# Altium project Large 2 Sided.PrjPcb
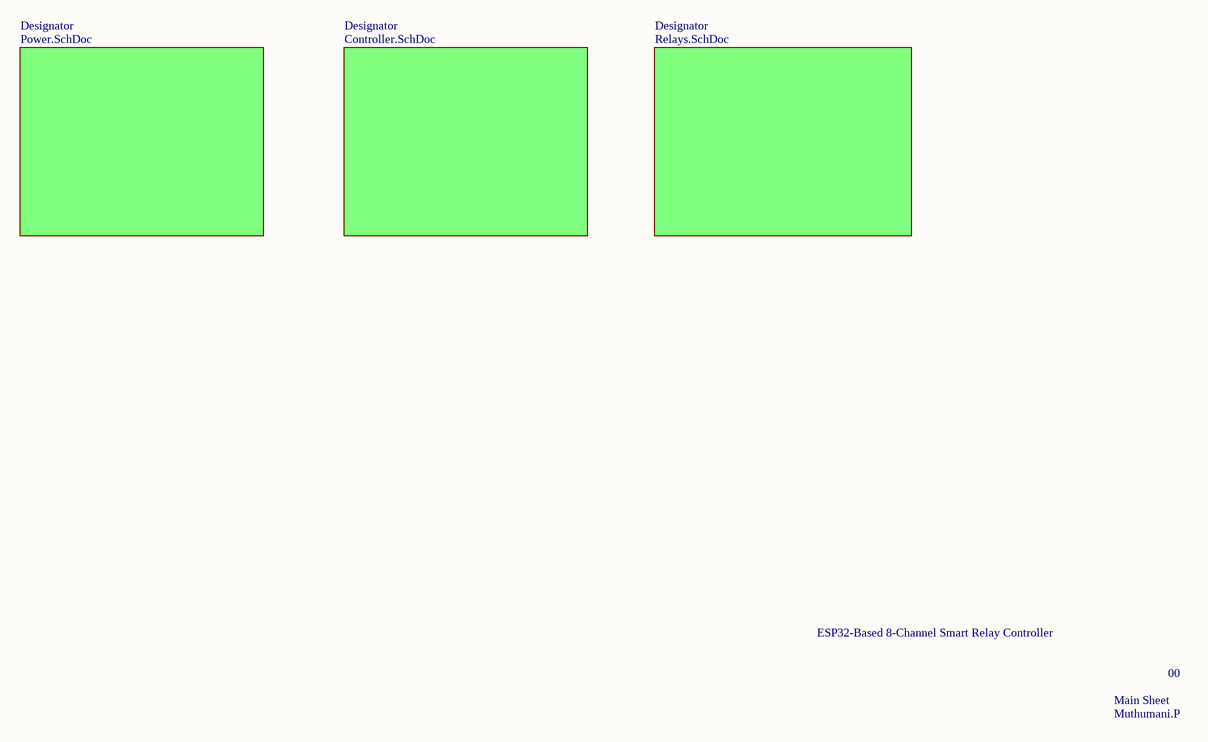
[diagram p0: Main.SchDoc]
4 sheets, 100 parts. Net scope: flat (ports and power ports of the same name join across sheets).
Board file: PCB1.PcbDoc
Sheets:
  Main.SchDoc
    Designator = Power.SchDoc
    Designator = Controller.SchDoc
    Designator = Relays.SchDoc

## Sheet Main.SchDoc
size A4; SheetNumber: 1; SheetTotal: 4

### Sub-sheets
Designator = Power.SchDoc: no entries
Designator = Controller.SchDoc: no entries
Designator = Relays.SchDoc: no entries

### Notes on the sheet
- ESP32-Based 8-Channel Smart Relay Controller
- Main Sheet
- 00
- Muthumani.P

## Sheet Power.SchDoc
size A4; SheetNumber: 2; SheetTotal: 4
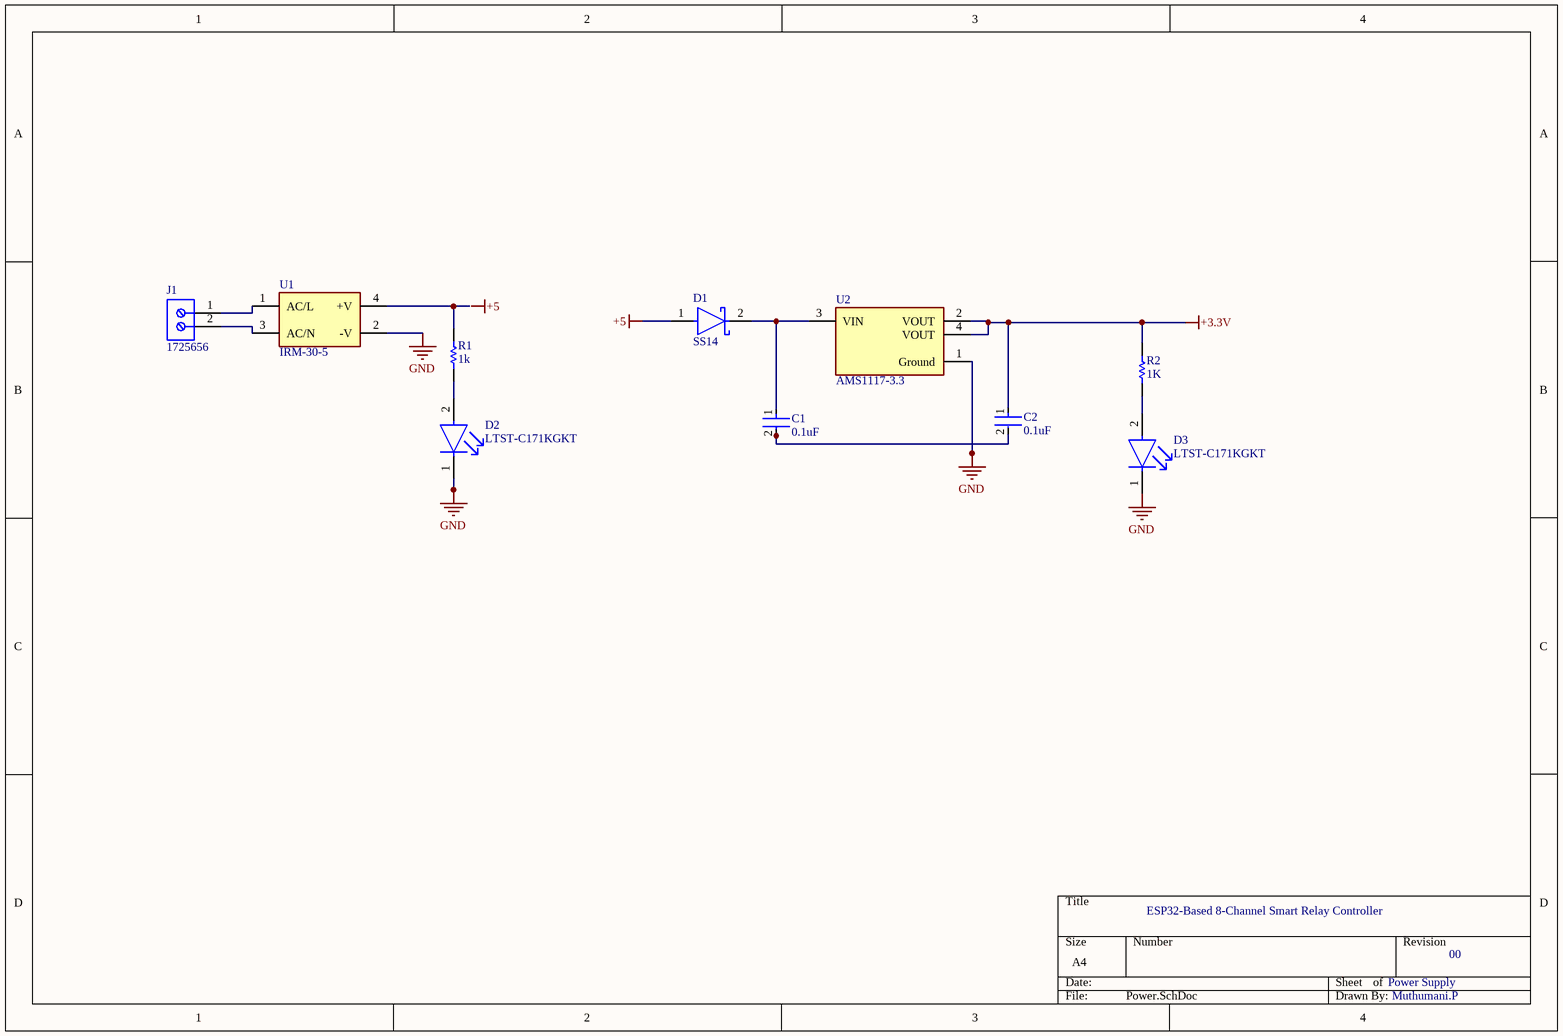
[diagram p1: Power.SchDoc]

### Parts
C1  0.1uF  [FP-1206-L_3_2_0_2-W_1_6_0-MFG]
C2  0.1uF  [FP-1206-L_3_2_0_2-W_1_6_0-MFG]
D1  SS14  [FP-403AE-MFG]
D2  LTST-C171KGKT  [FP-LTST-C171KGKT-MFG]
D3  LTST-C171KGKT  [FP-LTST-C171KGKT-MFG]
J1  1725656  [PHOE-1725656-2]
R1  1k  [RESC2013X60X35ML10T20]
R2  1K  [RESC2013X60X35ML10T20]
U1  IRM-30-5  [FP-IRM-30-5-MFG]
U2  AMS1117-3.3  [FP-AMS1117-IPC_C]

### Nets
+3.3V: C2.1 R2.2 U2.2(VOUT) U2.4(VOUT)
+5: D1.1(A)
GND: D2.1(C) D3.1(C) U1.2(-V) U2.1(Ground)
NetC1_1: C1.1 D1.2(C) U2.3(VIN)
NetC1_2: C1.2 C2.2
NetD2_2: D2.2(A) R1.1
NetD3_2: D3.2(A) R2.1
NetJ1_1: J1.1 U1.1(AC/L)
NetJ1_2: J1.2 U1.3(AC/N)
NetR1_2: R1.2 U1.4(+V)

### Notes on the sheet
- ESP32-Based 8-Channel Smart Relay Controller
- Power Supply
- 00
- Muthumani.P
- Labels drawn without touching a wire or pin: +5

### Library data of the parts
C1 C2 = CMP-04427-018471-1: General Purpose Ceramic Capacitor, 1206, 2.2uF, 20%, X7R, 15%, 100V; Package Quantity: 2500; Thickness: 0.037inch; Case/Package: 1206; Capacitance: 2.2uF; Length: 0.126inch; Packaging: Tape and Reel; Min Operating Temperature: -55°C; Voltage Rating: 100V; Mount: Surface Mount; Voltage Rating (DC): 100V; Tolerance: 20%; RoHS Compliant: Yes; Width: 0.063inch; Max Operating Temperature: 125°C
D1 = CMP-2000-04943-2: DIODE SCHOTTKY 40V 1A SMA; Manufacturer: ON Semiconductor; Peak Reverse Current: 0.2mA; Max Junction Temp: +125°C; Standoff Height: 0.05mm; Max Surge Forward Current: 40A; Mouser Description: Schottky Diodes & Rectifiers SMA 40V 1.0A; RoHS: TRUE; Lead Free: Yes; Manufacturer Part Number: SS14; Device Class L3: Schottky Diodes; Category: Diode; Automotive: No; Digikey Description: DIODE SCHOTTKY 40V 1A SMA; ComponentLink2Description: Datasheet; Device Class L2: Diodes; Height: 2.5mm; Temperature Range High: +125°C; ComponentLink2URL: https://www.onsemi.com/pub/Collateral/SS19-D.PDF; Device Class L1: Discrete Semiconductors; Package: 403AE; Octopart: https://octopart.com/ss14-on+semiconductor-29205033; Max Repetitive Reverse Voltage: 40V; Temperature Range Low: -65°C; Forward Current: 1A; Temperature: -65°C to +125°C
D2 D3 = CMP-22017-000037-1: LED GREEN CLEAR SMD; Number of LEDs: 1; Viewing Angle: 130°; Lens Style: Rectangular; Dominant Wavelength: 571nm; Test Current: 20mA; Luminous Intensity: 35mcd; Power Rating: 75mW; Forward Voltage: 2.4V; Forward Current: 30mA; Reverse Voltage: 5V; Lens Color: Colorless; Wavelength: 574nm; Height: 0.8mm; Illumination Color: Green; Length: 2mm; Case/Package: 0805; Number of Pins: 2; Number of Elements: 1; Package Quantity: 1; Depth: 1.25mm; Lens Transparency: Clear; Width: 1.25mm; Color: Green; Radiation Hardening: No; Mount: Surface Mount; Packaging: Tape and Reel; Case Code (Metric): 2012; Lead Free: Lead Free; Max Operating Temperature: 85°C; Min Operating Temperature: -55°C; Case Code (Imperial): 0805; Power Dissipation: 75mW
J1 = CMP-2000-05299-1: Male Header, Pitch 2.54 mm, 1 x 2 Position, Height 9 mm, Tail Length 3.5 mm; Manufacturer: Phoenix Contact; Number of contacts: 2; Content: 250pc(s); Pitch: 2.54mm; Industrial packaging: Yes; Colour: Green; Manufacturer part No.: 1725656; Type: MPT0,5/2-2,54; Datasheet URL: http://datasheet.octopart.com/1725656-Phoenix-Contact-datasheet-5302866.pdf; Manufacturer URL: http://www.phoenixcontact.com/; Datasheet Version: Apr-08
R1 R2 = CMP-2100-03671-1: Chip Resistor, 1 KOhm, +/- 1%, 125 mW, -55 to 155 degC, 0805 (2012 Metric), RoHS, Tape and Reel; Manufacturer: Yageo; Temperature Coefficient: 100ppm/degreesC; Voltage Rating (DC): 150V; Max Power Dissipation: 125mW; Resistance: 1KOhm; Number of Pins: 2; Number of Terminations: 2; Datasheet URL: http://www.yageo.com/NewPortal/yageodocoutput?fileName=/pdf/R-Chip/PYu-RC_Group_51_RoHS_L_5.pdf; Length: 0.079inch; Package Description: 2-Pin Surface Mounted Device, Body 2 x 1.25 mm; Depth: 1.25mm; Height: 0.024inch; Military Standard: Not; Case/Package: 0805; Package Reference: 0805; RoHSCompliant: true; Lead Free: LeadFree; Packaging: TapeandReel; Package Quantity: 1; Datasheet Version: Rev. 5, 10/2016; Tolerance: 1%; Min Operating Temperature: -55degC; Voltage Rating: 150V; Composition: ThickFilm; Case Code (Imperial): 0805; Power Rating: 125mW; Width: 0.049inch; Case Code (Metric): 2012; Manufacturer URL: http://www.yageo.com/; Max Operating Temperature: 155degC; REACH SVHC: Unknown; Termination: SMD/SMT
U1 = CMP-28435-000001-1: AC/DC CONVERTER 5V 30W; Manufacturer: Mean Well; Output Type: Fixed; Switching Topology: Buck; Max Supply Voltage: 264V; Number Of Outputs: 1; Switching Frequency: 65kHz; Nominal Supply Current: 0.5-0.75A; Min Supply Voltage: 85V; Output Current: 6A; Temperature: -30°C to +70°C; Device Class L1: Integrated Circuits (ICs); Temperature Range Low: -30°C; Temperature Range High: +70°C; ComponentLink2Description: Datasheet; Lead Free: Yes; Device Class L2: Power Management ICs; ComponentLink2URL: https://www.meanwell-web.com/content/files/pdfs/productPdfs/MW/IRM-30/IRM-30-spec.pdf; Mouser Description: 30W Encapsulated Board Mount Module AC/DC Power Supply with 5VDC Output; Automotive: No; Device Class L3: Voltage Regulators - Switching; Octopart: https://octopart.com/irm-30-5-mean+well-50976023; Category: IC; Package: IRM-30-5; Output Voltage: 5V; RoHS: TRUE; Manufacturer Part Number: IRM-30-5; Height: 24mm; Digikey Description: AC/DC CONVERTER 5V 30W
U2 = CMP-209535-000001-1: LDO Voltage Regulators 1A, 3.3V; Manufacturer: Advanced Monolithic Systems; Dropout Voltage: 1.1V; Output Type: Fixed; Nominal Supply Current: 5mA; Max Power Dissipation: 1.2W; Max Supply Voltage: 15V; Number Of Outputs: 1; Standoff Height: 0.64mm; Max Junction Temp: +125°C; Height: 1.8mm; Package: AMS1117; Device Class L2: Power Management ICs; ComponentLink2Description: Datasheet; ComponentLink2URL: http://www.advanced-monolithic.com/pdf/ds1117.pdf; Category: IC; RoHS: TRUE; Automotive: No; Device Class L1: Integrated Circuits (ICs); Output Current: 1A; Device Class L3: Voltage Regulators - Linear; Temperature: -40°C to +125°C; Output Voltage: 3.3V; Manufacturer Part Number: AMS1117-3.3; Temperature Range Low: -40°C; Octopart: https://octopart.com/ams1117-3.3-advanced+monolithic+systems-25899300; Lead Free: Yes; Ipc Land Pattern Name: SOT229P700X180-4; Temperature Range High: +125°C

## Sheet Controller.SchDoc
size A4; SheetNumber: 3; SheetTotal: 4
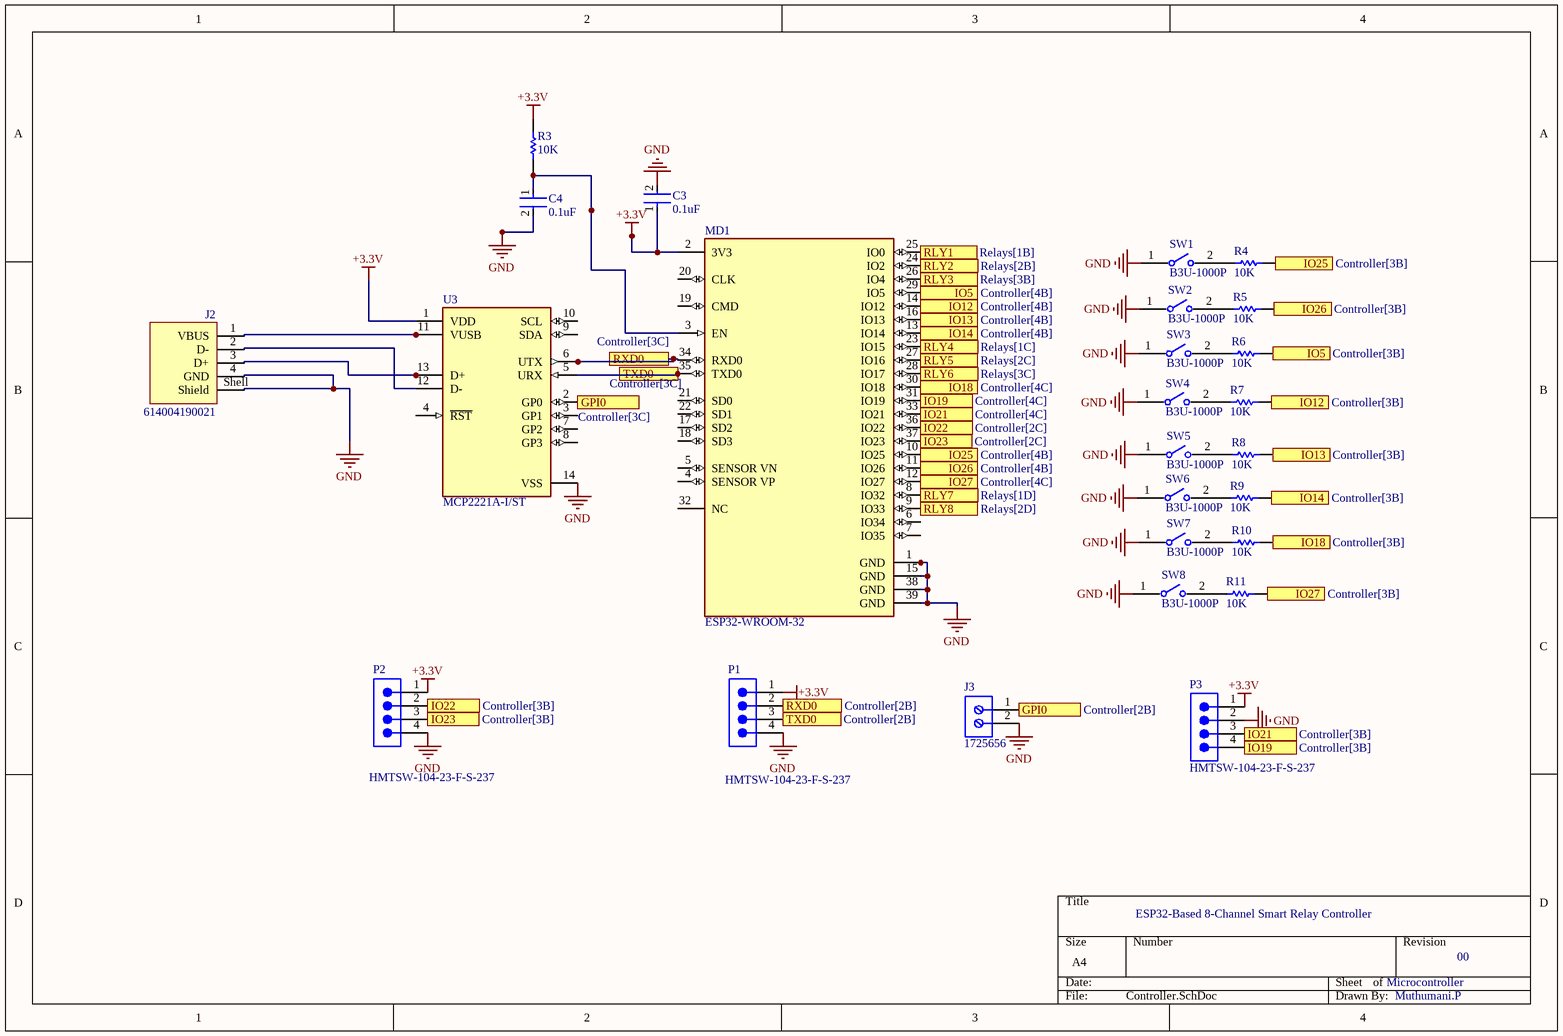
[diagram p2: Controller.SchDoc]

### Parts
C3  0.1uF  [FP-C1206C-EB-MFG]
C4  0.1uF  [FP-C1206C-EB-MFG]
J2  614004190021  [614004190021]
J3  1725656  [PHOE-1725656-2]
MD1  ESP32-WROOM-32  [FP-ESP32-WROOM-32-MFG]
P1  HMTSW-104-23-F-S-237  [SMTC-HMTSW-104-23-X-S-237]
P2  HMTSW-104-23-F-S-237  [SMTC-HMTSW-104-23-X-S-237]
P3  HMTSW-104-23-F-S-237  [SMTC-HMTSW-104-23-X-S-237]
R3  10K  [RESC2013X60X35NL10T20]
R4  10K  [RESC2013X60X35NL10T20]
R5  10K  [RESC2013X60X35NL10T20]
R6  10K  [RESC2013X60X35NL10T20]
R7  10K  [RESC2013X60X35NL10T20]
R8  10K  [RESC2013X60X35NL10T20]
R9  10K  [RESC2013X60X35NL10T20]
R10  10K  [RESC2013X60X35NL10T20]
R11  10K  [RESC2013X60X35NL10T20]
SW1  B3U-1000P  [FP-B3U-1000P-MFG]
SW2  B3U-1000P  [FP-B3U-1000P-MFG]
SW3  B3U-1000P  [FP-B3U-1000P-MFG]
SW4  B3U-1000P  [FP-B3U-1000P-MFG]
SW5  B3U-1000P  [FP-B3U-1000P-MFG]
SW6  B3U-1000P  [FP-B3U-1000P-MFG]
SW7  B3U-1000P  [FP-B3U-1000P-MFG]
SW8  B3U-1000P  [FP-B3U-1000P-MFG]
U3  MCP2221A-I/ST  [FP-C04-087-IPC_B]

### Ports
GPI0 (see Controller[2B]), GPI0 (see Controller[3C]), IO5 (in, see Controller[3B]), IO5 (in, see Controller[4B]), IO12 (in, see Controller[3B]), IO12 (in, see Controller[4B]), IO13 (in, see Controller[3B]), IO13 (in, see Controller[4B]), IO14 (in, see Controller[3B]), IO14 (in, see Controller[4B]), IO18 (in, see Controller[3B]), IO18 (in, see Controller[4C]), IO19 (see Controller[3B]), IO19 (see Controller[4C]), IO21 (see Controller[3B]), IO21 (see Controller[4C]), IO22 (see Controller[2C]), IO22 (see Controller[3B]), IO23 (see Controller[2C]), IO23 (see Controller[3B]), IO25 (in, see Controller[3B]), IO25 (in, see Controller[4B]), IO26 (in, see Controller[3B]), IO26 (in, see Controller[4B]), IO27 (in, see Controller[3B]), IO27 (in, see Controller[4C]), RLY1 (see Relays[1B]), RLY2 (see Relays[2B]), RLY3 (see Relays[3B]), RLY4 (see Relays[1C]), RLY5 (see Relays[2C]), RLY6 (see Relays[3C]), RLY7 (see Relays[1D]), RLY8 (see Relays[2D]), RXD0 (see Controller[2B]), RXD0 (see Controller[3C]), TXD0 (see Controller[2B]), TXD0 (see Controller[3C])

### Nets
+3.3V: C3.1 MD1.2(3V3) P1.1 P2.1 P3.1 R3.2 U3.1(VDD)
GND: C3.2 C4.2 J2.4(GND) J2.Shell(Shield) J3.2 MD1.1(GND) MD1.15(GND) MD1.38(GND) MD1.39(GND) P1.4 P2.4 P3.2 SW1.1 SW2.1 SW3.1 SW4.1 SW5.1 SW6.1 SW7.1 SW8.1 U3.14(VSS)
NetC4_1: C4.1 MD1.3(EN) R3.1
NetJ2_1: J2.1(VBUS) U3.11(VUSB)
NetJ2_2: J2.2(D-) U3.12(D-)
NetJ2_3: J2.3(D+) U3.13(D+)
NetJ3_1: J3.1 U3.2(GP0) ; port GPI0
NetMD1_8: MD1.8(IO32) ; port RLY7
NetMD1_9: MD1.9(IO33) ; port RLY8
NetMD1_10: MD1.10(IO25) R4.1 ; port IO25
NetMD1_11: MD1.11(IO26) R5.1 ; port IO26
NetMD1_12: MD1.12(IO27) R11.1 ; port IO27
NetMD1_13: MD1.13(IO14) R9.1 ; port IO14
NetMD1_14: MD1.14(IO12) R7.1 ; port IO12
NetMD1_16: MD1.16(IO13) R8.1 ; port IO13
NetMD1_23: MD1.23(IO15) ; port RLY4
NetMD1_24: MD1.24(IO2) ; port RLY2
NetMD1_25: MD1.25(IO0) ; port RLY1
NetMD1_26: MD1.26(IO4) ; port RLY3
NetMD1_27: MD1.27(IO16) ; port RLY5
NetMD1_28: MD1.28(IO17) ; port RLY6
NetMD1_29: MD1.29(IO5) R6.1 ; port IO5
NetMD1_30: MD1.30(IO18) R10.1 ; port IO18
NetMD1_31: MD1.31(IO19) P3.4 ; port IO19
NetMD1_33: MD1.33(IO21) P3.3 ; port IO21
NetMD1_34: MD1.34(RXD0) P1.2 U3.6(UTX) ; port RXD0
NetMD1_35: MD1.35(TXD0) P1.3 U3.5(URX) ; port TXD0
NetMD1_36: MD1.36(IO22) P2.2 ; port IO22
NetMD1_37: MD1.37(IO23) P2.3 ; port IO23
NetR4_2: R4.2 SW1.2
NetR5_2: R5.2 SW2.2
NetR6_2: R6.2 SW3.2
NetR7_2: R7.2 SW4.2
NetR8_2: R8.2 SW5.2
NetR9_2: R9.2 SW6.2
NetR10_2: R10.2 SW7.2
NetR11_2: R11.2 SW8.2

Not connected (* = marked no-connect by the designer): MD1 4(SENSOR_VP) 5(SENSOR_VN) 6(IO34) 7(IO35) 17(SD2) 18(SD3) 19(CMD) 20(CLK) 21(SD0) 22(SD1) 32(NC); U3 3(GP1) 4(~{RST}) 7(GP2) 8(GP3) 9(SDA) 10(SCL)

### Notes on the sheet
- ESP32-Based 8-Channel Smart Relay Controller
- Microcontroller
- 00
- Muthumani.P

### Library data of the parts
C3 C4 = CMP-03020-032951-1: C1206 0.22 μF X7R 5.00% 50 V; Manufacturer: KEMET; Manufacturer Part Number: C1206C224J5RAC; Value: 0.22 μF; Material: Ceramic; Tolerance: 0.05; Voltage Rating: 50 V; Automotive Grade: Grade 0; Temperature Coefficient: 15%; Octopart: https://octopart.com/c1206c224j5rac-kemet-1364890; Automotive: Yes; Temperature Characteristic: X7R; Package: C1206C-EB; Device Class L1: Passive Components; Device Class L2: Capacitors; Ipc Land Pattern Name: CAPC320160X78; Temperature: -55°C to +150°C; Mouser Description: Multilayer Ceramic Capacitors MLCC - SMD/SMT 50volts 0.22 uF 5% X7R; Temperature Range Low: -55°C; ComponentLink2URL: https://content.kemet.com/datasheets/KEM_C1007_X8R_ULTRA_150C_SMD.pdf; ComponentLink2Description: Datasheet; Temperature Range High: +150°C; Category: Cap; Height: 0.88mm; Capacitance: 0.22 μF; Device Class L3: Ceramic Capacitors; RoHS: TRUE; Lead Free: Yes
J2 = CMP-1502-03228-3: USB Connector, 2.0 TYPE A, RECEPTACLE, THT; Connector Type: USB Type A; Standard: USB 2.0; Gender: Receptacle; No. of...; USB Standard: USB 2.0; Insulation Resistance: 1GΩ; Current Rating: 3A; Number of Contacts: 4; Operating Supply Voltage: 30V; Contact Resistance: 30mΩ; Housing Color: White; Contact Material: Brass; Orientation: Horizontal; Connector Type: USB; Max Operating Temperature: 85°C; Contact Plating: Gold; Number of Pins: 4; REACH SVHC: No; Insulation Material: PBT; Min Operating Temperature: -40°C; Mount: Horizontal, Through Hole; RoHS: Compliant
J3 = CMP-2000-05299-1: as J1 on sheet Power; Colour: Green; Manufacturer part No.: 1725656; Type: MPT0,5/2-2,54; Datasheet URL: http://datasheet.octopart.com/1725656-Phoenix-Contact-datasheet-5302866.pdf; Manufacturer URL: http://www.phoenixcontact.com/; Datasheet Version: Apr-08
MD1 = CMP-194065-000008-1: RX TXRX MOD WIFI SURFACE MOUNT; Frequency: 2.5GHz; Sensitivity: -98dBm; Operating Supply Voltage: 3.6V; Data Rate: 150Mbps; Weight: 0.088185oz; Package Quantity: 550; Min Operating Temperature: -40°C; Mount: Surface Mount; Max Operating Temperature: 85°C; Packaging: Cut Tape; Case/Package: SMD/SMT
P1-P3 = CMP-1024-00021-1: Modified .025" SQ Post Header, Through-hole, Vertical, -55 to 125 degC, 2.54 mm Pitch, 4-Pin, Male, RoHS; Manufacturer: Samtec; Pitch: 2.54 mm; PackageReference: HMTSW-104-23-X-S-237; ComponentLink2URL: http://www.samtec.com/documents/webfiles/pdf/HMTSW.PDF; ComponentLink3Description: Package Specification; PartNumber: HMTSW-104-23-F-S-237; RoHS: True; ComponentLink2Description: Datasheet; Temperature Range: -55 to 125 degC; ComponentLink1Description: Manufacturer URL; DatasheetVersion: F-214; PackageDescription: Assembly .025 [.64] SQ. Post Hi-Temp Terminal Strip; Orientation: Vertical; PackageVersion: AL, 3/1987; Mounting Technology: Through-hole; ComponentLink1URL: http://www.samtec.com; ComponentLink3URL: http://www.samtec.com/documents/webfiles/cpdf/HMTSW-XXX-XX-X-X-XXXX-XX-XX-MKT1.pdf
R3-R11 = CMP-1659-00013-4: Chip Resistor, 10 KOhm, +/- 1%, 0.125 W, -55 to 155 degC, 0805 (2012 Metric), RoHS, Tape and Reel; Manufacturer: Yageo; Voltage Rating: 150 V; Mount: Surface Mount; ComponentLink1Description: Manufacturer URL; ComponentLink2URL: http://www.yageo.com/documents/recent/PYu-RC_Group_51_RoHS_L_04.pdf; Pins: 2; Length: 2 mm; Min Operating Temperature: -55 degC; Height: 0.5 mm; Mounting Technology: Surface Mount; RoHSCompliant: true; REACH SVHC: No SVHC; ComponentLink1URL: http://www.yageo.com/; Max Operating Temperature: 155 degC; PackageReference: 0805; DatasheetVersion: Rev. 4, 02/2016; Package Quantity: 5000; Packaging: Tape and Reel; ComponentLink2Description: Datasheet; PackageDescription: 2-Pin Surface Mounted Device, Body 2 x 1.25 mm
SW1-SW8 = CMP-2100-03586-2: SWITCH TACTILE SPST-NO 0.05A 12V; Contact Resistance: 100mR; Operating Force: 1.5N; Max Current Rating: 50mA; Switch Travel: 0.15mm; Actuator Type: Standard; Mechanical Life: 200000Cycles; Ratings: Dust Proof; Illumination Type: Non-Illuminated; Throw Configuration: SPST; Actuator Length: 0.4mm; Switch Function: Off-Mom; Height: 1.2mm; Width: 3mm; Weight: 0.000776oz; Contact Material: Silver; Max Voltage Rating (DC): 12V; Insulation Resistance: 100MR; Lead Free: Lead Free; Current Rating: 50mA; Termination: SMD/SMT; Length: 4mm; Voltage Rating (DC): 12V; Contact Current Rating: 50mA; Orientation: Straight; Depth: 2.5mm; Max Operating Temperature: 70°C; Packaging: Tape and Reel; Min Operating Temperature: -25°C; Package Quantity: 1; Mount: Surface Mount; Electrical Life: 200000Cycles
U3 = CMP-06284-000021-1: IC USB TO I2C/UART 14TSSOP; Interface: I2C; Operating Supply Current: 13mA; Packaging: Rail/Tube; Case/Package: TSSOP; Max Operating Temperature: 85°C; RoHS Compliant: Yes; Min Operating Temperature: -40°C

## Sheet Relays.SchDoc
size A4; SheetNumber: 4; SheetTotal: 4
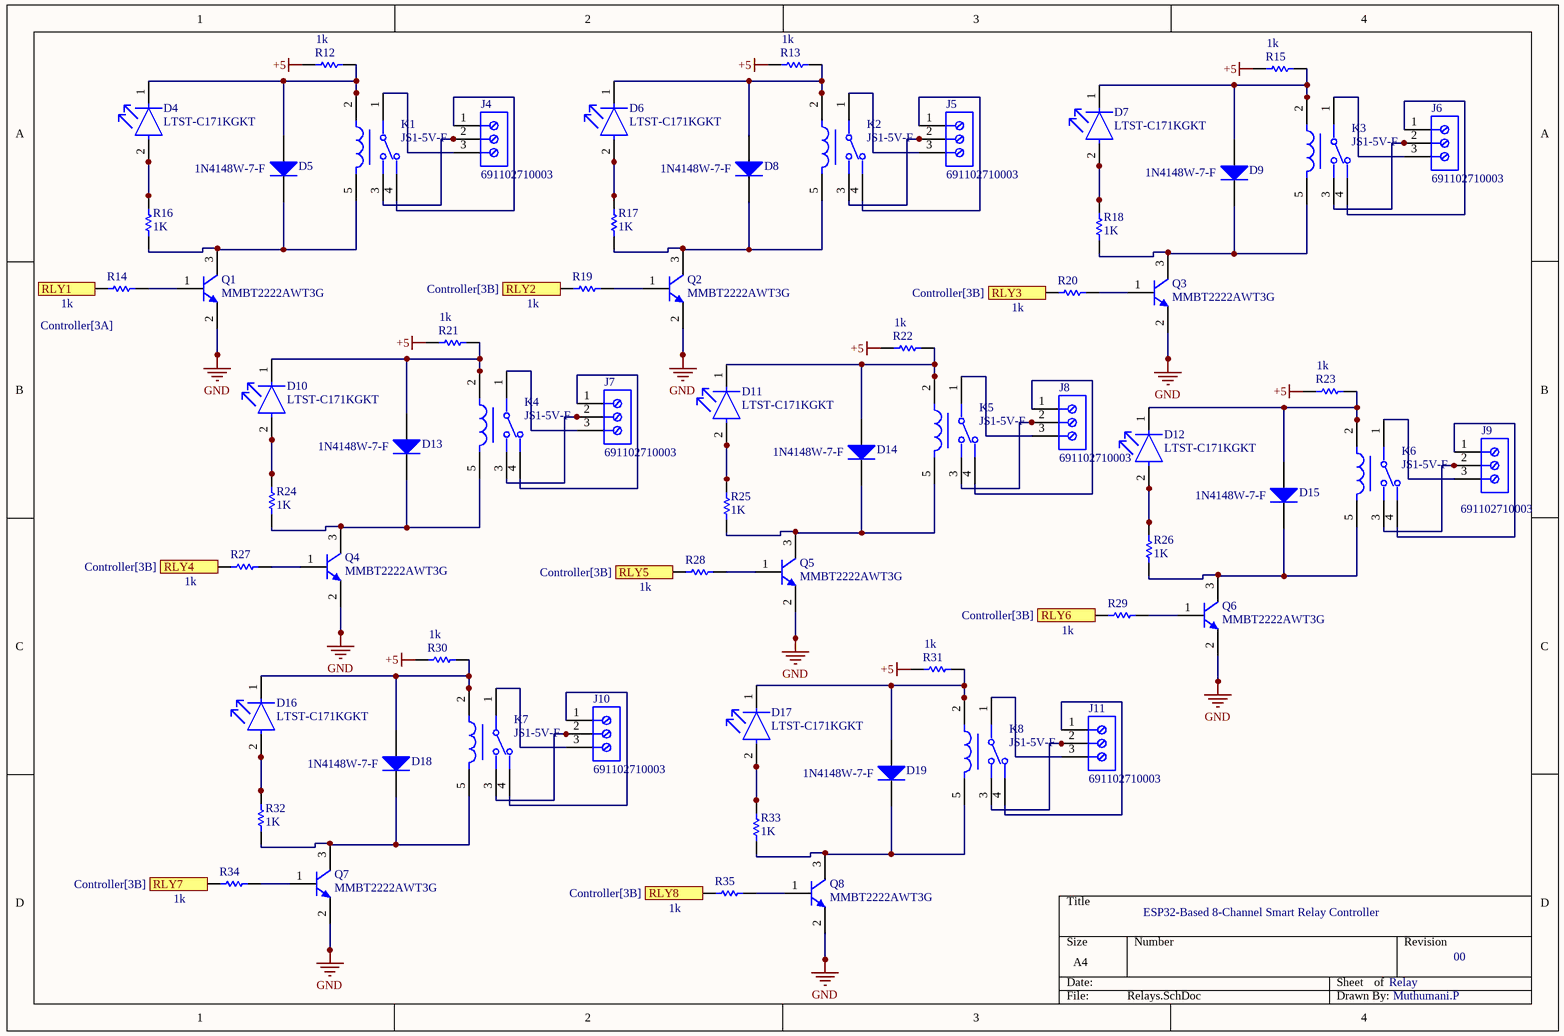
[diagram p3: Relays.SchDoc]

### Parts
D4  LTST-C171KGKT  [FP-LTST-C171KGKT-MFG]
D5  1N4148W-7-F  [DIOD-SOD123-2_V]
D6  LTST-C171KGKT  [FP-LTST-C171KGKT-MFG]
D7  LTST-C171KGKT  [FP-LTST-C171KGKT-MFG]
D8  1N4148W-7-F  [DIOD-SOD123-2_V]
D9  1N4148W-7-F  [DIOD-SOD123-2_V]
D10  LTST-C171KGKT  [FP-LTST-C171KGKT-MFG]
D11  LTST-C171KGKT  [FP-LTST-C171KGKT-MFG]
D12  LTST-C171KGKT  [FP-LTST-C171KGKT-MFG]
D13  1N4148W-7-F  [DIOD-SOD123-2_V]
D14  1N4148W-7-F  [DIOD-SOD123-2_V]
D15  1N4148W-7-F  [DIOD-SOD123-2_V]
D16  LTST-C171KGKT  [FP-LTST-C171KGKT-MFG]
D17  LTST-C171KGKT  [FP-LTST-C171KGKT-MFG]
D18  1N4148W-7-F  [DIOD-SOD123-2_V]
D19  1N4148W-7-F  [DIOD-SOD123-2_V]
J4  691102710003  [691102710003]
J5  691102710003  [691102710003]
J6  691102710003  [691102710003]
J7  691102710003  [691102710003]
J8  691102710003  [691102710003]
J9  691102710003  [691102710003]
J10  691102710003  [691102710003]
J11  691102710003  [691102710003]
K1  JS1-5V-F  [FP-JS1-5V-F-MFG]
K2  JS1-5V-F  [FP-JS1-5V-F-MFG]
K3  JS1-5V-F  [FP-JS1-5V-F-MFG]
K4  JS1-5V-F  [FP-JS1-5V-F-MFG]
K5  JS1-5V-F  [FP-JS1-5V-F-MFG]
K6  JS1-5V-F  [FP-JS1-5V-F-MFG]
K7  JS1-5V-F  [FP-JS1-5V-F-MFG]
K8  JS1-5V-F  [FP-JS1-5V-F-MFG]
Q1  MMBT2222AWT3G  [ONSC-SC-70-3-419-04_V]
Q2  MMBT2222AWT3G  [ONSC-SC-70-3-419-04_V]
Q3  MMBT2222AWT3G  [ONSC-SC-70-3-419-04_V]
Q4  MMBT2222AWT3G  [ONSC-SC-70-3-419-04_V]
Q5  MMBT2222AWT3G  [ONSC-SC-70-3-419-04_V]
Q6  MMBT2222AWT3G  [ONSC-SC-70-3-419-04_V]
Q7  MMBT2222AWT3G  [ONSC-SC-70-3-419-04_V]
Q8  MMBT2222AWT3G  [ONSC-SC-70-3-419-04_V]
R12  1k  [RESC2013X60X35ML10T20]
R13  1k  [RESC2013X60X35ML10T20]
R14  1k  [RESC2013X60X35ML10T20]
R15  1k  [RESC2013X60X35ML10T20]
R16  1K  [RESC2013X60X35ML10T20]
R17  1K  [RESC2013X60X35ML10T20]
R18  1K  [RESC2013X60X35ML10T20]
R19  1k  [RESC2013X60X35ML10T20]
R20  1k  [RESC2013X60X35ML10T20]
R21  1k  [RESC2013X60X35ML10T20]
R22  1k  [RESC2013X60X35ML10T20]
R23  1k  [RESC2013X60X35ML10T20]
R24  1K  [RESC2013X60X35ML10T20]
R25  1K  [RESC2013X60X35ML10T20]
R26  1K  [RESC2013X60X35ML10T20]
R27  1k  [RESC2013X60X35ML10T20]
R28  1k  [RESC2013X60X35ML10T20]
R29  1k  [RESC2013X60X35ML10T20]
R30  1k  [RESC2013X60X35ML10T20]
R31  1k  [RESC2013X60X35ML10T20]
R32  1K  [RESC2013X60X35ML10T20]
R33  1K  [RESC2013X60X35ML10T20]
R34  1k  [RESC2013X60X35ML10T20]
R35  1k  [RESC2013X60X35ML10T20]

### Ports
RLY1 (see Controller[3A]), RLY2 (see Controller[3B]), RLY3 (see Controller[3B]), RLY4 (see Controller[3B]), RLY5 (see Controller[3B]), RLY6 (see Controller[3B]), RLY7 (see Controller[3B]), RLY8 (see Controller[3B])

### Nets
+5: R12.2 R13.2 R15.2 R21.2 R22.2 R23.2 R30.2 R31.2
GND: Q1.2(E) Q2.2(E) Q3.2(E) Q4.2(E) Q5.2(E) Q6.2(E) Q7.2(E) Q8.2(E)
NetD4_1: D4.1(C) D5.1(A) K1.2(1_COIL) R12.1
NetD4_2: D4.2(A) R16.2
NetD5_2: D5.2(K) K1.5(2_COIL) Q1.3(C) R16.1
NetD6_1: D6.1(C) D8.1(A) K2.2(1_COIL) R13.1
NetD6_2: D6.2(A) R17.2
NetD7_1: D7.1(C) D9.1(A) K3.2(1_COIL) R15.1
NetD7_2: D7.2(A) R18.2
NetD8_2: D8.2(K) K2.5(2_COIL) Q2.3(C) R17.1
NetD9_2: D9.2(K) K3.5(2_COIL) Q3.3(C) R18.1
NetD10_1: D10.1(C) D13.1(A) K4.2(1_COIL) R21.1
NetD10_2: D10.2(A) R24.2
NetD11_1: D11.1(C) D14.1(A) K5.2(1_COIL) R22.1
NetD11_2: D11.2(A) R25.2
NetD12_1: D12.1(C) D15.1(A) K6.2(1_COIL) R23.1
NetD12_2: D12.2(A) R26.2
NetD13_2: D13.2(K) K4.5(2_COIL) Q4.3(C) R24.1
NetD14_2: D14.2(K) K5.5(2_COIL) Q5.3(C) R25.1
NetD15_2: D15.2(K) K6.5(2_COIL) Q6.3(C) R26.1
NetD16_1: D16.1(C) D18.1(A) K7.2(1_COIL) R30.1
NetD16_2: D16.2(A) R32.2
NetD17_1: D17.1(C) D19.1(A) K8.2(1_COIL) R31.1
NetD17_2: D17.2(A) R33.2
NetD18_2: D18.2(K) K7.5(2_COIL) Q7.3(C) R32.1
NetD19_2: D19.2(K) K8.5(2_COIL) Q8.3(C) R33.1
NetJ4_1: J4.1 K1.4(N.C.)
NetJ4_2: J4.2 K1.3(N.O.)
NetJ4_3: J4.3 K1.1(COM)
NetJ5_1: J5.1 K2.4(N.C.)
NetJ5_2: J5.2 K2.3(N.O.)
NetJ5_3: J5.3 K2.1(COM)
NetJ6_1: J6.1 K3.4(N.C.)
NetJ6_2: J6.2 K3.3(N.O.)
NetJ6_3: J6.3 K3.1(COM)
NetJ7_1: J7.1 K4.4(N.C.)
NetJ7_2: J7.2 K4.3(N.O.)
NetJ7_3: J7.3 K4.1(COM)
NetJ8_1: J8.1 K5.4(N.C.)
NetJ8_2: J8.2 K5.3(N.O.)
NetJ8_3: J8.3 K5.1(COM)
NetJ9_1: J9.1 K6.4(N.C.)
NetJ9_2: J9.2 K6.3(N.O.)
NetJ9_3: J9.3 K6.1(COM)
NetJ10_1: J10.1 K7.4(N.C.)
NetJ10_2: J10.2 K7.3(N.O.)
NetJ10_3: J10.3 K7.1(COM)
NetJ11_1: J11.1 K8.4(N.C.)
NetJ11_2: J11.2 K8.3(N.O.)
NetJ11_3: J11.3 K8.1(COM)
NetMD1_8: R34.1 ; port RLY7
NetMD1_9: R35.1 ; port RLY8
NetMD1_23: R27.1 ; port RLY4
NetMD1_24: R19.1 ; port RLY2
NetMD1_25: R14.1 ; port RLY1
NetMD1_26: R20.1 ; port RLY3
NetMD1_27: R28.1 ; port RLY5
NetMD1_28: R29.1 ; port RLY6
NetQ1_1: Q1.1(B) R14.2
NetQ2_1: Q2.1(B) R19.2
NetQ3_1: Q3.1(B) R20.2
NetQ4_1: Q4.1(B) R27.2
NetQ5_1: Q5.1(B) R28.2
NetQ6_1: Q6.1(B) R29.2
NetQ7_1: Q7.1(B) R34.2
NetQ8_1: Q8.1(B) R35.2

### Notes on the sheet
- ESP32-Based 8-Channel Smart Relay Controller
- Relay
- 00
- Muthumani.P

### Library data of the parts
D4 D6 D7 D10-D12 D16 D17 = CMP-22017-000037-1: as D2 on sheet Power; Height: 0.8mm; Illumination Color: Green; Length: 2mm; Case/Package: 0805; Number of Pins: 2; Number of Elements: 1; Package Quantity: 1; Depth: 1.25mm; Lens Transparency: Clear; Width: 1.25mm; Color: Green; Radiation Hardening: No; Mount: Surface Mount; Packaging: Tape and Reel; Case Code (Metric): 2012; Lead Free: Lead Free; Max Operating Temperature: 85°C; Min Operating Temperature: -55°C; Case Code (Imperial): 0805; Power Dissipation: 75mW
D5 D8 D9 D13-D15 D18 D19 = CMP-2000-04932-2: Fast Switching Diode, 100 V, 0.15 A, -65 to 150 degC, 2-Pin?SOD123, RoHS, Tape and Reel; Recovery Time: 4ns; Brand: DiodesIncorporated; Unit Weight: 0.000353oz; Max Surge Current: 2A; Peak Reverse Voltage: 100V; Ir - Reverse Current: 1uA; Vf - Forward Voltage: 1.25V; Configuration: Single; If - Forward Current: 0.15A; Product Category: Diodes-GeneralPurpose,Power,Switching; Operating Temperature Range: -65Cto+150C; Packaging: Reel; Manufacturer URL: http://www.diodes.com/; Maximum Operating Temperature: +150C; Height: 1.25mm; Minimum Operating Temperature: -65C; Product: SwitchingDiodes; Package URL: http://www.diodes.com/datasheets/ds18004.pdf; Type: SwitchingDiode; Package Reference: SOD123-2; Width: 1.7mm; Datasheet URL: http://www.farnell.com/datasheets/1915529.pdf; Datasheet Version: Rev. 24-2, 10/2013; Series: 1N4148; Factory Pack Quantity: 3000; Length: 2.85mm; RoHS: True; Manufacturer: DiodesIncorporated; Mounting Style: SMD/SMT; Package / Case: SOD-123
J4-J11 = CMP-1502-03259-3: 102 Series 5MM Pitch Straight, Pcb Terminal Block, Through Hole, 3 Way; Current: 15A; Wire Gauge (Max): 22AWG; Voltage: 300V; Number of Contacts: 3; Plating: Steel; Number of Levels: 1; Stripping Length: -6mm; Wire Gauge (Min): 14AWG; Pitch: 5.0038mm; Contact Plating: Tin; Wire/Cable Gauge: 22AWG; Number of Positions Per Level: 3; Min Operating Temperature: -40°C; Housing Material: Nylon; Length: 7.5mm; Contact Material: Brass; RoHS: Compliant; Max Operating Temperature: 105°C; Voltage Rating: 300V; Number of Pins: 3; Current Rating: 15A; Packaging: Box; Termination: Screw; Lead Pitch: 5mm; Color: Blue; Width: 16.2mm; Mount: Through Hole; Height: 13.4mm
K1-K8 = CMP-05606-000016-1: RELAY GEN PURPOSE SPDT 10A 5V; Manufacturer: Panasonic; Coil Type: Non-Latching; Number Of Contacts: 1; Standoff Height: 0.3mm; Switching Power: 150W; Coil Power: 360mW; Coil Current: 72mA; Coil Resistance: 69.4Ω; Lead Free: Yes; Device Class L3: Power Relays; Device Class L1: Electromechanical; Ambient Temperature Range High: +70°C; Temperature: -40°C to +70°C; Temperature Range High: +70°C; Temperature Range Low: -40°C; Manufacturer Part Number: JS1-5V-F; Coil Voltage: 5V; Switching Current: 10A; Digikey Description: RELAY GEN PURPOSE SPDT 10A 5V; Device Class L2: Relays; Ambient Temperature Range Low: -40°C; Throw Configuration: SPDT; Category: Relay; ComponentLink2URL: https://www3.panasonic.biz/ac/e_download/control/relay/power/catalog/mech_eng_js.pdf?via=ok; Package: JS1-5V-F; Octopart: https://octopart.com/js1-5v-f-panasonic-39428621; Mouser Description: JS Series 10 A SPDT 5 V Through Hole Sealed Miniature Non-Polarized Power Relay; Height: 16.8mm; ComponentLink2Description: Datasheet; RoHS: TRUE; Automotive: No
Q1-Q8 = CMP-1048-00383-1: General Purpose Transistor, NPN Silicon, 3-Pin SC70, Pb-Free, Tape and Reel; Manufacturer: On Semiconductor; IC Continuous (A): 0.6; fT Min (MHz): 300; Polarity: NPN; DatasheetVersion: Rev. 6; RoHS: TRUE; ComponentLink3Description: Package Specification; PackageDescription: 3-Pin Small Outline Transistor, Body 2 x 1.25 mm, Pitch 0.65 mm; PackageReference: SC-70-3-419-04; Mounting Technology: Surface Mount; PackageVersion: Rev. N, 11/2008; ComponentLink1Description: Manufacturer URL; PartNumber: MMBT2222AWT3G; Packing: Tape and Reel; ComponentLink3URL: http://www.onsemi.cn/pub_link/Collateral/419-04.PDF; ComponentLink2URL: http://www.onsemi.cn/pub_link/Collateral/MMBT2222AWT1-D.PDF; ComponentLink1URL: http://www.onsemi.com/; ComponentLink2Description: Datasheet
R12-R35 = CMP-2100-03671-1: as R1 on sheet Power; Number of Pins: 2; Number of Terminations: 2; Datasheet URL: http://www.yageo.com/NewPortal/yageodocoutput?fileName=/pdf/R-Chip/PYu-RC_Group_51_RoHS_L_5.pdf; Length: 0.079inch; Package Description: 2-Pin Surface Mounted Device, Body 2 x 1.25 mm; Depth: 1.25mm; Height: 0.024inch; Military Standard: Not; Case/Package: 0805; Package Reference: 0805; RoHSCompliant: true; Lead Free: LeadFree; Packaging: TapeandReel; Package Quantity: 1; Datasheet Version: Rev. 5, 10/2016; Tolerance: 1%; Min Operating Temperature: -55degC; Voltage Rating: 150V; Composition: ThickFilm; Case Code (Imperial): 0805; Power Rating: 125mW; Width: 0.049inch; Case Code (Metric): 2012; Manufacturer URL: http://www.yageo.com/; Max Operating Temperature: 155degC; REACH SVHC: Unknown; Termination: SMD/SMT

## Nets that join several sheets
+3.3V: Power (C2.1 R2.2 U2.2 U2.4), Controller (7 pins)
+5: Power (D1.1), Relays (8 pins)
GND: Power (D2.1 D3.1 U1.2 U2.1), Controller (21 pins), Relays (8 pins)
NetMD1_8: Controller (MD1.8), Relays (R34.1)
NetMD1_9: Controller (MD1.9), Relays (R35.1)
NetMD1_23: Controller (MD1.23), Relays (R27.1)
NetMD1_24: Controller (MD1.24), Relays (R19.1)
NetMD1_25: Controller (MD1.25), Relays (R14.1)
NetMD1_26: Controller (MD1.26), Relays (R20.1)
NetMD1_27: Controller (MD1.27), Relays (R28.1)
NetMD1_28: Controller (MD1.28), Relays (R29.1)